# EAGLE design fpc-30-lcd_ERM12864-6 (EAGLE 9.6.2)
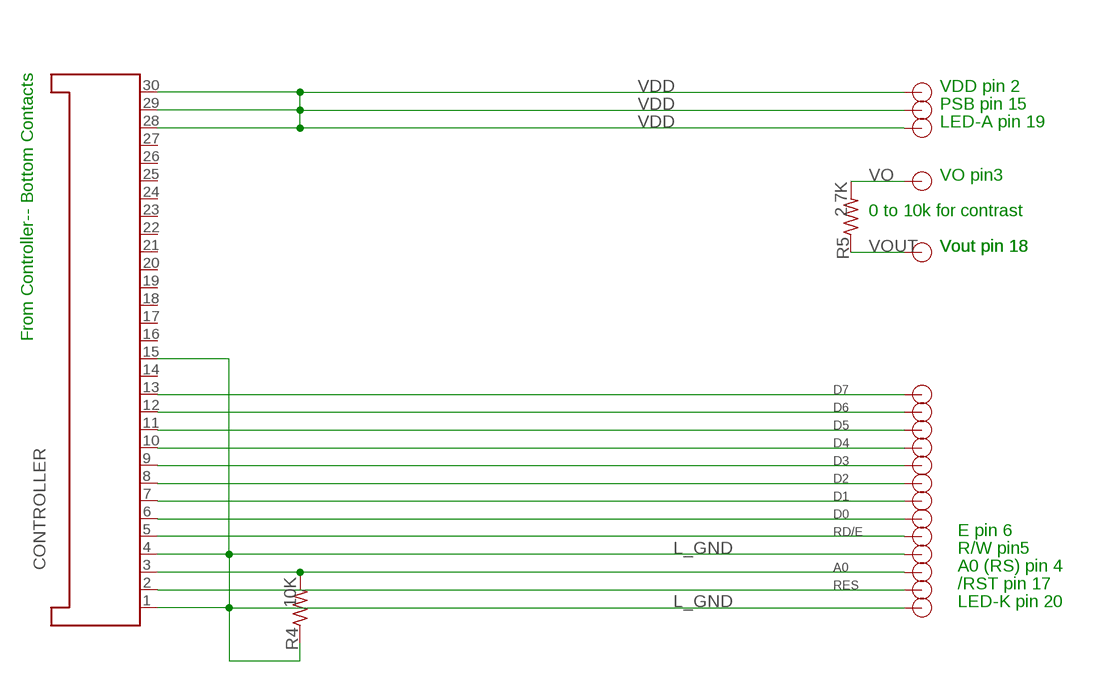
[diagram p0: schematic, sheet 1]

## Parts
/RST  TP-1  [TP]
A0/RS  TP-1  [TP]
CONTROLLER  FPC30-Top_pins  FPC_30-PINS  [FH12-30S-0.5SH]
D0  D7  TP-1  [TP]
D1  TP-1  [TP]
D2  TP-1  [TP]
D3  TP-1  [TP]
D4  TP-1  [TP]
D5  TP-1  [TP]
D6  TP-1  [TP]
D7  D7  TP-1  [TP]
LED_A  TP-1  [TP]
LED_K  TP-1  [TP]
PSB  TP-1  [TP]
R4  10K  R-US_R0603  [R0603]
R5  2.7K  R-US_R0603  [R0603]
R/W  TP-1  [TP]
RD/E  TP-1  [TP]
VDD  TP-1  [TP]
VO  D7  TP-1  [TP]
VOUT  D7  TP-1  [TP]

## Nets
A0: A0/RS.P$1 CONTROLLER.3 R4.2
D0: CONTROLLER.6 D0.P$1
D1: CONTROLLER.7 D1.P$1
D2: CONTROLLER.8 D2.P$1
D3: CONTROLLER.9 D3.P$1
D4: CONTROLLER.10 D4.P$1
D5: CONTROLLER.11 D5.P$1
D6: CONTROLLER.12 D6.P$1
D7: CONTROLLER.13 D7.P$1
L_GND: CONTROLLER.1 CONTROLLER.4 CONTROLLER.15 LED_K.P$1 R4.1 R/W.P$1
RD/E: CONTROLLER.5 RD/E.P$1
RES: /RST.P$1 CONTROLLER.2
VDD: CONTROLLER.28 CONTROLLER.29 CONTROLLER.30 LED_A.P$1 PSB.P$1 VDD.P$1
VO: R5.2 VO.P$1
VOUT: R5.1 VOUT.P$1
Unconnected: CONTROLLER.14 CONTROLLER.16 CONTROLLER.17 CONTROLLER.18 CONTROLLER.19 CONTROLLER.20 CONTROLLER.21 CONTROLLER.22 CONTROLLER.23 CONTROLLER.24 CONTROLLER.25 CONTROLLER.26 CONTROLLER.27

## Notes on the sheet
- VDD pin 2
- PSB pin 15
- LED-A pin 19
- VO pin3
- 0 to 10k for contrast
- Vout pin 18 | Vout pin 18
- From Controller-- Bottom Contacts
- E pin 6
- R/W pin5
- A0 (RS) pin 4
- /RST pin 17
- LED-K pin 20

## Library data of the parts
/RST A0/RS D0 D1-D7 LED_A LED_K PSB R/W RD/E VDD VO VOUT = XP9300:TP-1
CONTROLLER = XP9300:FPC_30-PINS; DIGIKEY: 732-3517-ND
R4 R5 = rcl:R-US_: RESISTOR, American symbol; SPICEPREFIX: R

## Board
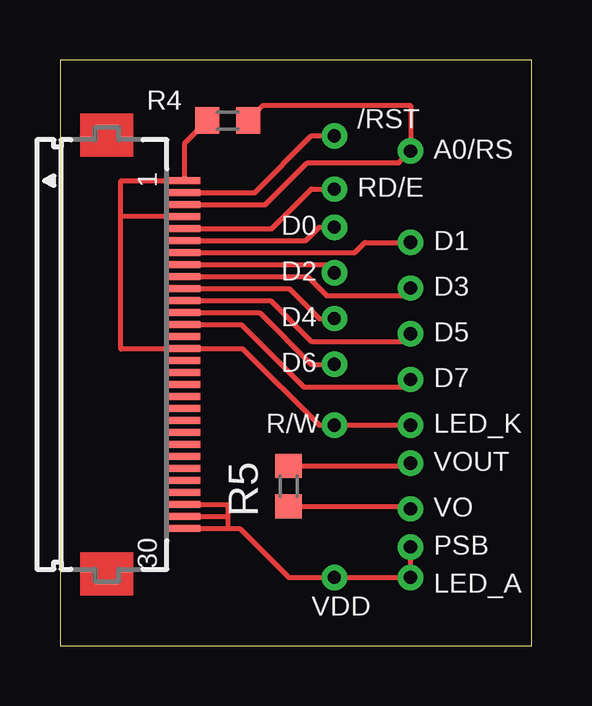
[diagram p1: board, top side]

Size 19.67 x 24.44 mm. Coordinates in mm from the lower left corner, seen from the top.
Outline: 0,0 19.67,0 19.67,24.44 0,24.44 0,0
Copper layers (1*16): Top 0.035mm / dielectric 1.5mm / Bottom 0.035mm
Design rules "default": minimum track width 6mil, minimum drill 0.35mm, track to track 6mil, track to pad 6mil, pad to pad 6mil, via to via 6mil, smd to smd 6mil, copper to edge 40mil, drill to drill 6mil, minimum pad ring 10mil, minimum via ring 8mil, stop-mask expansion 4mil, vias tented up to drill 0mil, thermal gap 10mil

### Footprints (pad centres in the part's own frame; a part is rotated, then mirrored left to right if it is on the bottom)
TP = drill 0.55: P$1 0,0
FH12-30S-0.5SH = smd 0.3 x 1.3: 1 -7.02,2.66; 2 -6.52,2.66; 3 -6.02,2.66; 4 -5.52,2.66; 5 -5.02,2.66; 6 -4.52,2.66; 7 -4.02,2.66; 8 -3.52,2.66; 9 -3.02,2.66; 10 -2.52,2.66; 11 -2.02,2.66; 12 -1.52,2.66; 13 -1.02,2.66; 14 -0.52,2.66; 15 -0.02,2.66; 16 0.48,2.66; 17 0.98,2.66; 18 1.48,2.66; 19 1.98,2.66; 20 2.48,2.66; 21 2.98,2.66; 22 3.48,2.66; 23 3.98,2.66; 24 4.48,2.66; 25 4.98,2.66; 26 5.48,2.66; 27 5.98,2.66; 28 6.48,2.66; 29 6.98,2.66; 30 7.48,2.66
R0603 = smd 1 x 1.1: 1 -0.85,0; 2 0.85,0

### Placement (x,y rotation side)
/RST  11.43,21.27 0 top
A0/RS  14.6,20.64 0 top
CONTROLLER  2.54,12.38 270 top
D0  11.43,17.46 0 top
D1  14.6,16.83 0 top
D2  11.43,15.56 0 top
D3  14.6,14.92 0 top
D4  11.43,13.65 0 top
D5  14.6,13.02 0 top
D6  11.43,11.75 0 top
D7  14.6,11.11 0 top
LED_A  14.6,2.86 0 top
LED_K  14.6,9.21 0 top
PSB  14.6,4.13 0 top
R4  6.98,21.91 0 top
R5  9.53,6.67 270 top
R/W  11.43,9.21 0 top
RD/E  11.43,19.05 0 top
VDD  11.43,2.86 0 top
VO  14.6,5.71 0 top
VOUT  14.6,7.62 0 top

### Tracks (layer width: path | path; a pad name or v marks a point on that pad's centre or on a via)
A0
  Top 0.203: CONTROLLER.3 8.56,18.4 10.31,20.15 14.12,20.15 A0/RS.P$1 14.6,22.54 8.47,22.54 R4.2
D0
  Top 0.203: CONTROLLER.6 10.23,16.9 10.79,17.46 D0.P$1
D1
  Top 0.203: CONTROLLER.7 12.28,16.4 12.7,16.83 D1.P$1
D2
  Top 0.203: CONTROLLER.8 11.08,15.9 D2.P$1
D3
  Top 0.203: CONTROLLER.9 10.31,15.4 11.11,14.6 14.29,14.6 D3.P$1
D4
  Top 0.203: CONTROLLER.10 9.54,14.9 10.79,13.65 D4.P$1
D5
  Top 0.203: CONTROLLER.11 8.78,14.4 10.48,12.7 14.29,12.7 D5.P$1
D6
  Top 0.203: CONTROLLER.12 8.32,13.9 10.48,11.75 D6.P$1
D7
  Top 0.203: CONTROLLER.13 7.55,13.4 10.16,10.8 14.29,10.8 D7.P$1
L_GND
  Top 0.203: CONTROLLER.15 5.18,12.38 | R4.1 5.2,20.97 CONTROLLER.1 2.54,19.4 2.54,17.9 | CONTROLLER.15 7.6,12.4 10.79,9.21 R/W.P$1 LED_K.P$1 | CONTROLLER.15 5.2,12.38 2.54,12.38 2.54,17.9 | CONTROLLER.4 2.54,17.9
RD/E
  Top 0.203: CONTROLLER.5 8.83,17.4 10.48,19.05 RD/E.P$1
RES
  Top 0.203: CONTROLLER.2 8.11,18.9 10.48,21.27 /RST.P$1
VDD
  Top 0.203: CONTROLLER.30 6.98,4.9 | 6.98,4.9 7.48,4.9 9.53,2.86 VDD.P$1 LED_A.P$1 PSB.P$1 | CONTROLLER.28 6.98,5.9 6.98,5.4 | 6.98,4.9 6.98,5.4 | CONTROLLER.29 6.98,5.4
VO
  Top 0.203: R5.2 14.5,5.82 VO.P$1
VOUT
  Top 0.203: R5.1 14.5,7.52 VOUT.P$1